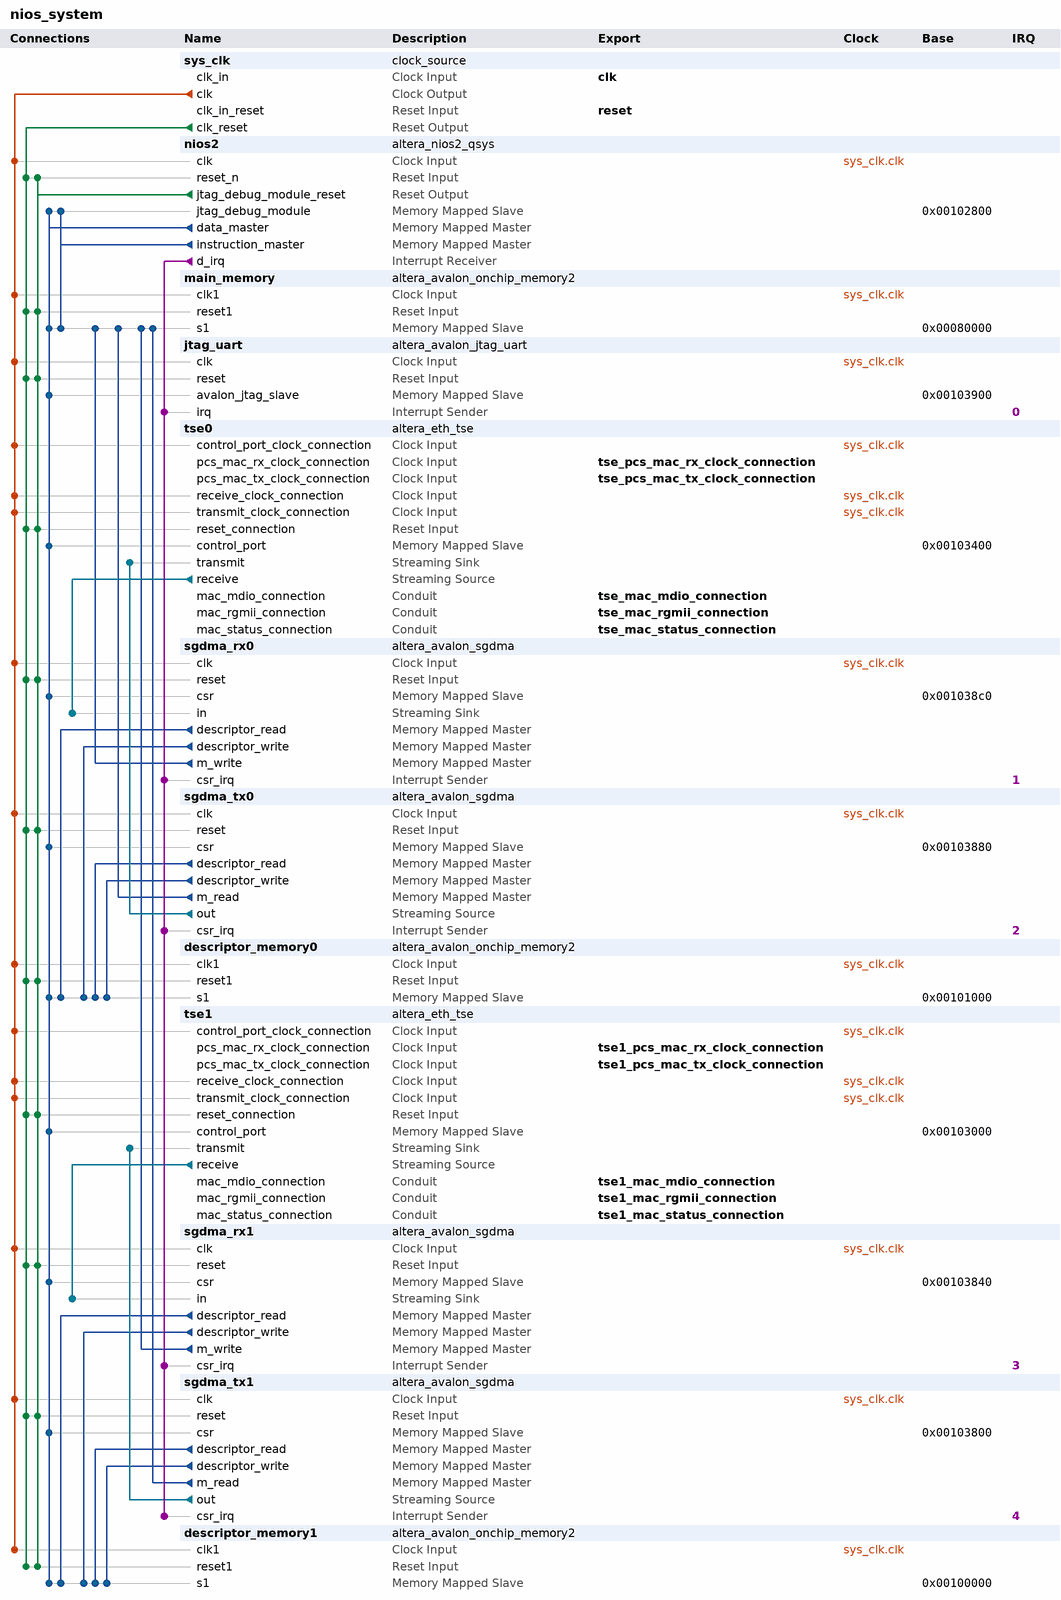
[diagram p0: system contents]
# Platform Designer (Qsys) system nios_system, Cyclone IV E EP4CE115F29C7
# Parameters at their usual value, and those the tool derives, are not listed.
package require -exact qsys 16.1
create_system nios_system
set_project_property DEVICE_FAMILY {Cyclone IV E}
set_project_property DEVICE EP4CE115F29C7

add_instance sys_clk clock_source 16.1
set_instance_parameter_value sys_clk clockFrequency 100000000

add_instance nios2 altera_nios2_qsys 16.1
set_instance_parameter_value nios2 breakSlave nios2.jtag_debug_module
set_instance_parameter_value nios2 exceptionSlave main_memory.s1
set_instance_parameter_value nios2 icache_size 4096
set_instance_parameter_value nios2 impl Small
set_instance_parameter_value nios2 mmu_TLBMissExcSlave None
set_instance_parameter_value nios2 resetSlave main_memory.s1
set_instance_parameter_value nios2 resetrequest_enabled true

add_instance main_memory altera_avalon_onchip_memory2 16.1
set_instance_parameter_value main_memory dataWidth 32
set_instance_parameter_value main_memory dualPort false
set_instance_parameter_value main_memory initMemContent true
set_instance_parameter_value main_memory initializationFileName onchip_mem.hex
set_instance_parameter_value main_memory memorySize 307200

add_instance jtag_uart altera_avalon_jtag_uart 16.1
set_instance_parameter_value jtag_uart simInteractiveOptions NO_INTERACTIVE_WINDOWS

add_instance tse0 altera_eth_tse 16.1
set_instance_parameter_value tse0 core_variation MAC_ONLY
set_instance_parameter_value tse0 enable_hd_logic true
set_instance_parameter_value tse0 enable_mac_flow_ctrl false
set_instance_parameter_value tse0 enable_magic_detect true
set_instance_parameter_value tse0 enable_shift16 true
set_instance_parameter_value tse0 ifGMII RGMII
set_instance_parameter_value tse0 ing_addr 11
set_instance_parameter_value tse0 mdio_clk_div 40
set_instance_parameter_value tse0 stat_cnt_ena true
set_instance_parameter_value tse0 transceiver_type NONE

add_instance sgdma_rx0 altera_avalon_sgdma 16.1
set_instance_parameter_value sgdma_rx0 enableBurstTransfers false
set_instance_parameter_value sgdma_rx0 enableUnalignedTransfers false
set_instance_parameter_value sgdma_rx0 readBlockDataWidth 32
set_instance_parameter_value sgdma_rx0 sinkErrorWidth 6
set_instance_parameter_value sgdma_rx0 sourceErrorWidth 0
set_instance_parameter_value sgdma_rx0 transferMode STREAM_TO_MEMORY
set_instance_parameter_value sgdma_rx0 writeBurstcountWidth 4

add_instance sgdma_tx0 altera_avalon_sgdma 16.1
set_instance_parameter_value sgdma_tx0 enableBurstTransfers false
set_instance_parameter_value sgdma_tx0 enableUnalignedTransfers false
set_instance_parameter_value sgdma_tx0 readBlockDataWidth 32
set_instance_parameter_value sgdma_tx0 sinkErrorWidth 0
set_instance_parameter_value sgdma_tx0 sourceErrorWidth 1
set_instance_parameter_value sgdma_tx0 transferMode MEMORY_TO_STREAM
set_instance_parameter_value sgdma_tx0 writeBurstcountWidth 4

add_instance descriptor_memory0 altera_avalon_onchip_memory2 16.1
set_instance_parameter_value descriptor_memory0 dataWidth 32
set_instance_parameter_value descriptor_memory0 dualPort false
set_instance_parameter_value descriptor_memory0 initMemContent true
set_instance_parameter_value descriptor_memory0 initializationFileName onchip_mem.hex
set_instance_parameter_value descriptor_memory0 memorySize 4096

add_instance tse1 altera_eth_tse 16.1
set_instance_parameter_value tse1 core_variation MAC_ONLY
set_instance_parameter_value tse1 enable_hd_logic true
set_instance_parameter_value tse1 enable_mac_flow_ctrl false
set_instance_parameter_value tse1 enable_magic_detect true
set_instance_parameter_value tse1 enable_shift16 true
set_instance_parameter_value tse1 ifGMII RGMII
set_instance_parameter_value tse1 ing_addr 11
set_instance_parameter_value tse1 mdio_clk_div 40
set_instance_parameter_value tse1 stat_cnt_ena true
set_instance_parameter_value tse1 transceiver_type NONE

add_instance sgdma_rx1 altera_avalon_sgdma 16.1
set_instance_parameter_value sgdma_rx1 enableBurstTransfers false
set_instance_parameter_value sgdma_rx1 enableUnalignedTransfers false
set_instance_parameter_value sgdma_rx1 readBlockDataWidth 32
set_instance_parameter_value sgdma_rx1 sinkErrorWidth 6
set_instance_parameter_value sgdma_rx1 sourceErrorWidth 0
set_instance_parameter_value sgdma_rx1 transferMode STREAM_TO_MEMORY
set_instance_parameter_value sgdma_rx1 writeBurstcountWidth 4

add_instance sgdma_tx1 altera_avalon_sgdma 16.1
set_instance_parameter_value sgdma_tx1 enableBurstTransfers false
set_instance_parameter_value sgdma_tx1 enableUnalignedTransfers false
set_instance_parameter_value sgdma_tx1 readBlockDataWidth 32
set_instance_parameter_value sgdma_tx1 sinkErrorWidth 0
set_instance_parameter_value sgdma_tx1 sourceErrorWidth 1
set_instance_parameter_value sgdma_tx1 transferMode MEMORY_TO_STREAM
set_instance_parameter_value sgdma_tx1 writeBurstcountWidth 4

add_instance descriptor_memory1 altera_avalon_onchip_memory2 16.1
set_instance_parameter_value descriptor_memory1 dataWidth 32
set_instance_parameter_value descriptor_memory1 dualPort false
set_instance_parameter_value descriptor_memory1 initMemContent true
set_instance_parameter_value descriptor_memory1 initializationFileName onchip_mem.hex
set_instance_parameter_value descriptor_memory1 memorySize 4096

# connections
add_connection sys_clk.clk descriptor_memory0.clk1 clock
add_connection sys_clk.clk descriptor_memory1.clk1 clock
add_connection sys_clk.clk jtag_uart.clk clock
add_connection sys_clk.clk main_memory.clk1 clock
add_connection sys_clk.clk nios2.clk clock
add_connection sys_clk.clk sgdma_rx0.clk clock
add_connection sys_clk.clk sgdma_rx1.clk clock
add_connection sys_clk.clk sgdma_tx0.clk clock
add_connection sys_clk.clk sgdma_tx1.clk clock
add_connection sys_clk.clk tse0.control_port_clock_connection clock
add_connection sys_clk.clk tse0.receive_clock_connection clock
add_connection sys_clk.clk tse0.transmit_clock_connection clock
add_connection sys_clk.clk tse1.control_port_clock_connection clock
add_connection sys_clk.clk tse1.receive_clock_connection clock
add_connection sys_clk.clk tse1.transmit_clock_connection clock
add_connection nios2.jtag_debug_module_reset descriptor_memory0.reset1 reset
add_connection nios2.jtag_debug_module_reset descriptor_memory1.reset1 reset
add_connection nios2.jtag_debug_module_reset jtag_uart.reset reset
add_connection nios2.jtag_debug_module_reset main_memory.reset1 reset
add_connection nios2.jtag_debug_module_reset nios2.reset_n reset
add_connection nios2.jtag_debug_module_reset sgdma_rx0.reset reset
add_connection nios2.jtag_debug_module_reset sgdma_rx1.reset reset
add_connection nios2.jtag_debug_module_reset sgdma_tx0.reset reset
add_connection nios2.jtag_debug_module_reset sgdma_tx1.reset reset
add_connection nios2.jtag_debug_module_reset tse0.reset_connection reset
add_connection nios2.jtag_debug_module_reset tse1.reset_connection reset
add_connection sys_clk.clk_reset descriptor_memory0.reset1 reset
add_connection sys_clk.clk_reset descriptor_memory1.reset1 reset
add_connection sys_clk.clk_reset jtag_uart.reset reset
add_connection sys_clk.clk_reset main_memory.reset1 reset
add_connection sys_clk.clk_reset nios2.reset_n reset
add_connection sys_clk.clk_reset sgdma_rx0.reset reset
add_connection sys_clk.clk_reset sgdma_rx1.reset reset
add_connection sys_clk.clk_reset sgdma_tx0.reset reset
add_connection sys_clk.clk_reset sgdma_tx1.reset reset
add_connection sys_clk.clk_reset tse0.reset_connection reset
add_connection sys_clk.clk_reset tse1.reset_connection reset
add_connection nios2.data_master descriptor_memory0.s1 avalon
set_connection_parameter_value nios2.data_master/descriptor_memory0.s1 baseAddress 0x00101000
add_connection nios2.data_master descriptor_memory1.s1 avalon
set_connection_parameter_value nios2.data_master/descriptor_memory1.s1 baseAddress 0x00100000
add_connection nios2.data_master jtag_uart.avalon_jtag_slave avalon
set_connection_parameter_value nios2.data_master/jtag_uart.avalon_jtag_slave baseAddress 0x00103900
add_connection nios2.data_master main_memory.s1 avalon
set_connection_parameter_value nios2.data_master/main_memory.s1 baseAddress 0x00080000
add_connection nios2.data_master nios2.jtag_debug_module avalon
set_connection_parameter_value nios2.data_master/nios2.jtag_debug_module baseAddress 0x00102800
add_connection nios2.data_master sgdma_rx0.csr avalon
set_connection_parameter_value nios2.data_master/sgdma_rx0.csr baseAddress 0x001038c0
add_connection nios2.data_master sgdma_rx1.csr avalon
set_connection_parameter_value nios2.data_master/sgdma_rx1.csr baseAddress 0x00103840
add_connection nios2.data_master sgdma_tx0.csr avalon
set_connection_parameter_value nios2.data_master/sgdma_tx0.csr baseAddress 0x00103880
add_connection nios2.data_master sgdma_tx1.csr avalon
set_connection_parameter_value nios2.data_master/sgdma_tx1.csr baseAddress 0x00103800
add_connection nios2.data_master tse0.control_port avalon
set_connection_parameter_value nios2.data_master/tse0.control_port baseAddress 0x00103400
add_connection nios2.data_master tse1.control_port avalon
set_connection_parameter_value nios2.data_master/tse1.control_port baseAddress 0x00103000
add_connection nios2.instruction_master main_memory.s1 avalon
set_connection_parameter_value nios2.instruction_master/main_memory.s1 baseAddress 0x00080000
add_connection nios2.instruction_master nios2.jtag_debug_module avalon
set_connection_parameter_value nios2.instruction_master/nios2.jtag_debug_module baseAddress 0x00102800
add_connection sgdma_rx0.descriptor_read descriptor_memory0.s1 avalon
set_connection_parameter_value sgdma_rx0.descriptor_read/descriptor_memory0.s1 baseAddress 0x00101000
add_connection sgdma_rx0.descriptor_write descriptor_memory0.s1 avalon
set_connection_parameter_value sgdma_rx0.descriptor_write/descriptor_memory0.s1 baseAddress 0x00101000
add_connection sgdma_rx0.m_write main_memory.s1 avalon
set_connection_parameter_value sgdma_rx0.m_write/main_memory.s1 baseAddress 0x00080000
add_connection sgdma_rx1.descriptor_read descriptor_memory1.s1 avalon
set_connection_parameter_value sgdma_rx1.descriptor_read/descriptor_memory1.s1 baseAddress 0x00100000
add_connection sgdma_rx1.descriptor_write descriptor_memory1.s1 avalon
set_connection_parameter_value sgdma_rx1.descriptor_write/descriptor_memory1.s1 baseAddress 0x00100000
add_connection sgdma_rx1.m_write main_memory.s1 avalon
set_connection_parameter_value sgdma_rx1.m_write/main_memory.s1 baseAddress 0x00080000
add_connection sgdma_tx0.descriptor_read descriptor_memory0.s1 avalon
set_connection_parameter_value sgdma_tx0.descriptor_read/descriptor_memory0.s1 baseAddress 0x00101000
add_connection sgdma_tx0.descriptor_write descriptor_memory0.s1 avalon
set_connection_parameter_value sgdma_tx0.descriptor_write/descriptor_memory0.s1 baseAddress 0x00101000
add_connection sgdma_tx0.m_read main_memory.s1 avalon
set_connection_parameter_value sgdma_tx0.m_read/main_memory.s1 baseAddress 0x00080000
add_connection sgdma_tx1.descriptor_read descriptor_memory1.s1 avalon
set_connection_parameter_value sgdma_tx1.descriptor_read/descriptor_memory1.s1 baseAddress 0x00100000
add_connection sgdma_tx1.descriptor_write descriptor_memory1.s1 avalon
set_connection_parameter_value sgdma_tx1.descriptor_write/descriptor_memory1.s1 baseAddress 0x00100000
add_connection sgdma_tx1.m_read main_memory.s1 avalon
set_connection_parameter_value sgdma_tx1.m_read/main_memory.s1 baseAddress 0x00080000
add_connection sgdma_tx0.out tse0.transmit avalon_streaming
add_connection sgdma_tx1.out tse1.transmit avalon_streaming
add_connection tse0.receive sgdma_rx0.in avalon_streaming
add_connection tse1.receive sgdma_rx1.in avalon_streaming
add_connection nios2.d_irq jtag_uart.irq interrupt
set_connection_parameter_value nios2.d_irq/jtag_uart.irq irqNumber 0
add_connection nios2.d_irq sgdma_rx0.csr_irq interrupt
set_connection_parameter_value nios2.d_irq/sgdma_rx0.csr_irq irqNumber 1
add_connection nios2.d_irq sgdma_rx1.csr_irq interrupt
set_connection_parameter_value nios2.d_irq/sgdma_rx1.csr_irq irqNumber 3
add_connection nios2.d_irq sgdma_tx0.csr_irq interrupt
set_connection_parameter_value nios2.d_irq/sgdma_tx0.csr_irq irqNumber 2
add_connection nios2.d_irq sgdma_tx1.csr_irq interrupt
set_connection_parameter_value nios2.d_irq/sgdma_tx1.csr_irq irqNumber 4

# exported interfaces
add_interface clk clock sink
set_interface_property clk EXPORT_OF sys_clk.clk_in
add_interface reset reset sink
set_interface_property reset EXPORT_OF sys_clk.clk_in_reset
add_interface tse1_mac_mdio_connection conduit end
set_interface_property tse1_mac_mdio_connection EXPORT_OF tse1.mac_mdio_connection
add_interface tse1_mac_rgmii_connection conduit end
set_interface_property tse1_mac_rgmii_connection EXPORT_OF tse1.mac_rgmii_connection
add_interface tse1_mac_status_connection conduit end
set_interface_property tse1_mac_status_connection EXPORT_OF tse1.mac_status_connection
add_interface tse1_pcs_mac_rx_clock_connection clock sink
set_interface_property tse1_pcs_mac_rx_clock_connection EXPORT_OF tse1.pcs_mac_rx_clock_connection
add_interface tse1_pcs_mac_tx_clock_connection clock sink
set_interface_property tse1_pcs_mac_tx_clock_connection EXPORT_OF tse1.pcs_mac_tx_clock_connection
add_interface tse_mac_mdio_connection conduit end
set_interface_property tse_mac_mdio_connection EXPORT_OF tse0.mac_mdio_connection
add_interface tse_mac_rgmii_connection conduit end
set_interface_property tse_mac_rgmii_connection EXPORT_OF tse0.mac_rgmii_connection
add_interface tse_mac_status_connection conduit end
set_interface_property tse_mac_status_connection EXPORT_OF tse0.mac_status_connection
add_interface tse_pcs_mac_rx_clock_connection clock sink
set_interface_property tse_pcs_mac_rx_clock_connection EXPORT_OF tse0.pcs_mac_rx_clock_connection
add_interface tse_pcs_mac_tx_clock_connection clock sink
set_interface_property tse_pcs_mac_tx_clock_connection EXPORT_OF tse0.pcs_mac_tx_clock_connection

set_interconnect_requirement {$system} qsys_mm.clockCrossingAdapter HANDSHAKE
set_interconnect_requirement {$system} qsys_mm.enableEccProtection FALSE
set_interconnect_requirement {$system} qsys_mm.insertDefaultSlave FALSE
set_interconnect_requirement {$system} qsys_mm.maxAdditionalLatency 1

save_system nios_system.qsys
